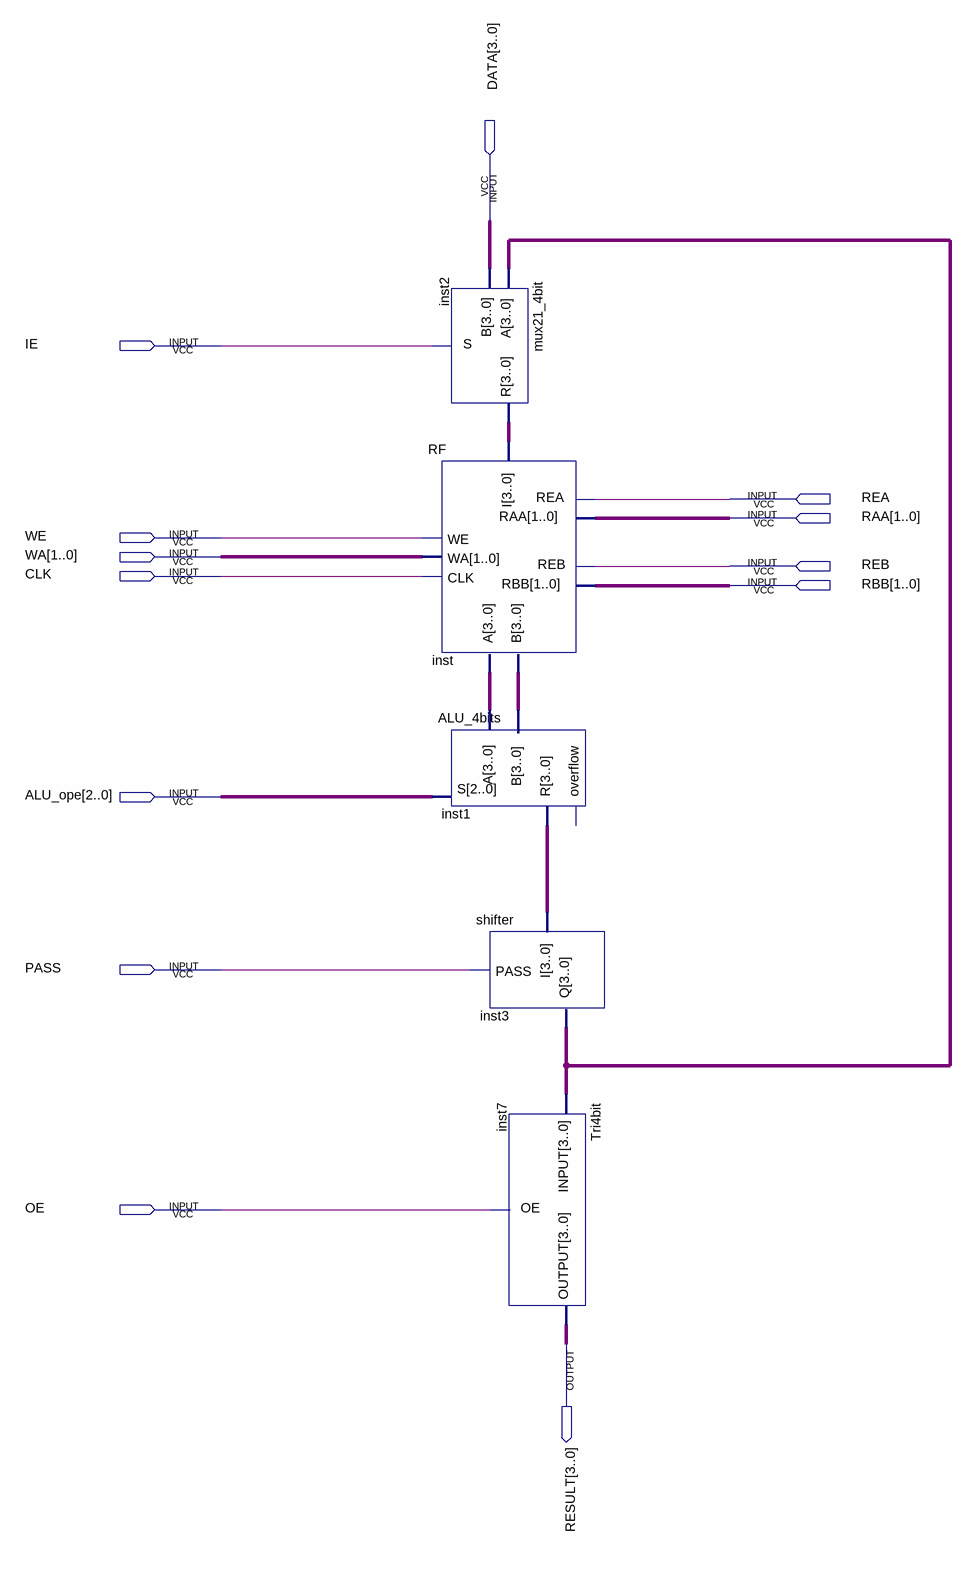
[diagram p0: schematic sheet]
// Quartus schematic datapath.bdf as structural Verilog: 5 symbols, 13 pins
module datapath (
  input  [3:0] DATA,
  input  IE,
  input  REA,
  input  [1:0] RAA,
  input  WE,
  input  [1:0] WA,
  input  REB,
  input  CLK,
  input  [1:0] RBB,
  input  [2:0] ALU_ope,
  input  PASS,
  input  OE,
  output [3:0] RESULT
);

  wire [3:0] inst1_r, inst2_r, inst3_q, inst_a, inst_b;

  RF inst (
    .I(inst2_r), .REA(REA), .RAA(RAA), .WE(WE), .WA(WA), .CLK(CLK), .REB(REB), .RBB(RBB), .A(inst_a),
    .B(inst_b));
  mux21_4bit inst2 (.A(inst3_q), .B(DATA), .S(IE), .R(inst2_r));
  ALU_4bits inst1 (.A(inst_a), .B(inst_b), .S(ALU_ope), .R(inst1_r));  // open: overflow
  shifter inst3 (.I(inst1_r), .PASS(PASS), .Q(inst3_q));
  Tri4bit inst7 (.INPUT(inst3_q), .OE(OE), .OUTPUT(RESULT));
endmodule
